# EAGLE design mainV1.0 (EAGLE 8.6.0)
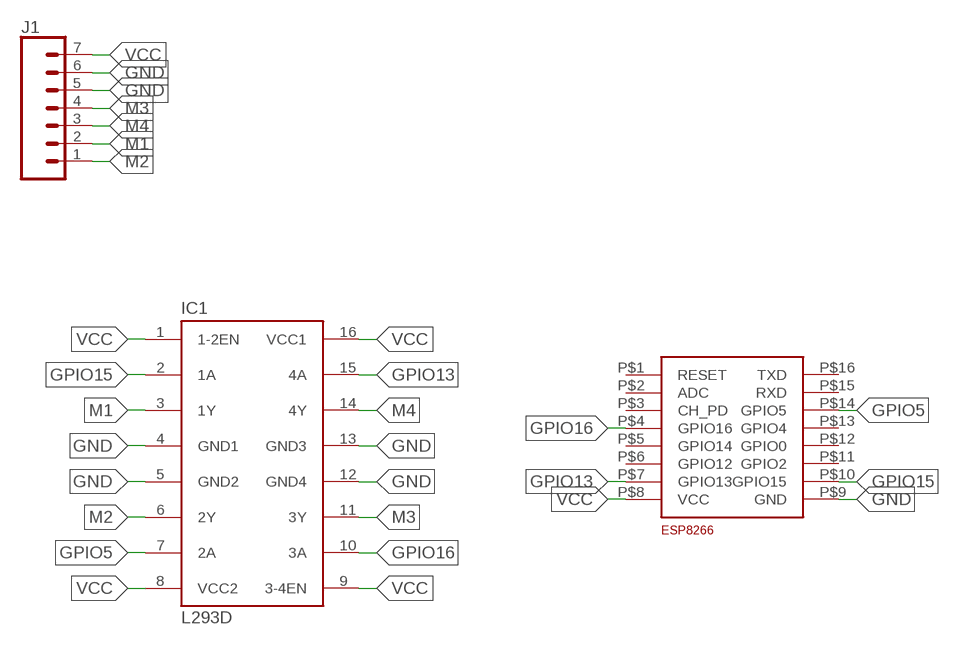
[diagram p0: schematic, sheet 1]

## Parts
IC1  L293D  [DIL16]
J1  CONN_07  [1X07]
U$1  ESP_THIAGO  [ESP_THIAGO]

## Nets
GND: IC1.4(GND1) IC1.5(GND2) IC1.12(GND4) IC1.13(GND3) J1.5 J1.6 U$1.P$9(GND)
GPIO5: IC1.7(2A) U$1.P$14(GPIO5)
GPIO13: IC1.15(4A) U$1.P$7(GPIO13)
GPIO15: IC1.2(1A) U$1.P$10(GPIO15)
GPIO16: IC1.10(3A) U$1.P$4(GPIO16)
M1: IC1.3(1Y) J1.2
M2: IC1.6(2Y) J1.1
M3: IC1.11(3Y) J1.4
M4: IC1.14(4Y) J1.3
N$1: IC1.8(VCC2)
VCC: IC1.1(1-2EN) IC1.9(3-4EN) IC1.16(VCC1) J1.7 U$1.P$8(VCC)
Unconnected: U$1.P$1(RESET) U$1.P$2(ADC) U$1.P$3(CH_PD) U$1.P$5(GPIO14) U$1.P$6(GPIO12) U$1.P$11(GPIO2) U$1.P$12(GPIO0) U$1.P$13(GPIO4) U$1.P$15(RXD) U$1.P$16(TXD)

## Library data of the parts
IC1 = st-microelectronics:L293D: PUSH-PULL 4 CHANNEL DRIVER; MPN: L293D; OC_FARNELL: 9589619; OC_NEWARK: 56P8249
J1 = SparkFun-Connectors:CONN_07: Multi connection point. Often used as Generic Header-pin footprint for 0.1 inch spaced/style header connections On any of the 0.1 inch spaced packages, you can populate with these: Break Away Headers - Straight <https://www.sparkfun.com/products/116> (PRT-00116) Break Away Male Headers - Right Angle <https://www.sparkfun.com/products/553> (PRT-00553) Female Headers <https://www.sparkfun.com/products/115> (PRT-00115) Break Away Headers - Machine Pin <https://www.sparkfun.com/products/117> (PRT-00117) Break Away Female Headers - Swiss Machine Pin <https://www.sparkfun.com/products/743> (PRT-00743) For SCREWTERMINALS and SPRING TERMINALS visit here: Screw Terimnals on SparkFun.com <https://www.sparkfun.com/search/results?term=Screw+Terminals> (5mm/3.5mm/2.54mm spacing) This device is also useful as a general connection point to wire up your design to another part of your project. Our various solder wires solder well into these plated through hole pads. Hook-Up Wire - Assortment (Stranded, 22 AWG) <https://www.sparkfun.com/products/11375> (PRT-11375) Hook-Up Wire - Assortment (Solid Core, 22 AWG) <https://www.sparkfun.com/products/11367> (PRT-11367) View the entire wire category on our website here <https://www.sparkfun.com/categories/141> Special notes: Molex polarized connector foot print use with SKU : PRT-08231 with associated crimp pins and housings. 1MM SMD Version SKU: PRT-10208 NOTES ON THE VARIANTS LOCK and LOCK_LONGPADS... This footprint was designed to help hold the alignment of a through-hole component (i.e. 6-pin header) while soldering it into place. You may notice that each hole has been shifted either up or down by 0.005 of an inch from it's more standard position (which is a perfectly straight line). This slight alteration caused the pins (the squares in the middle) to touch the edges of the holes. Because they are alternating, it causes a "brace" to hold the component in place. 0.005 has proven to be the perfect amount of "off-center" position when using our standard breakaway headers. Although looks a little odd when you look at the bare footprint, once you have a header in there, the alteration is very hard to notice. Also,if you push a header all the way into place, it is covered up entirely on the bottom side.
U$1 = esp8266:ESP_THIAGO

## Board
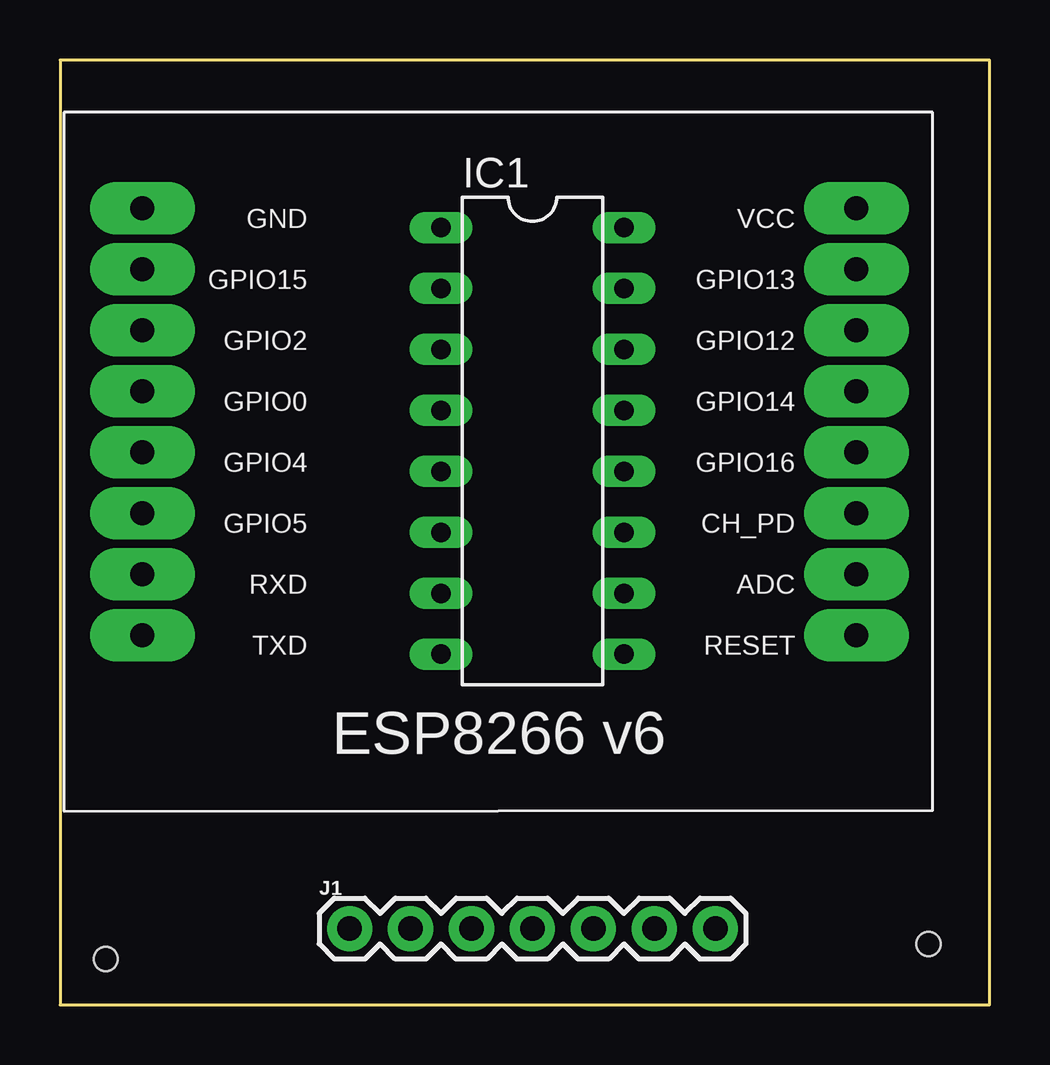
[diagram p1: board, top side]
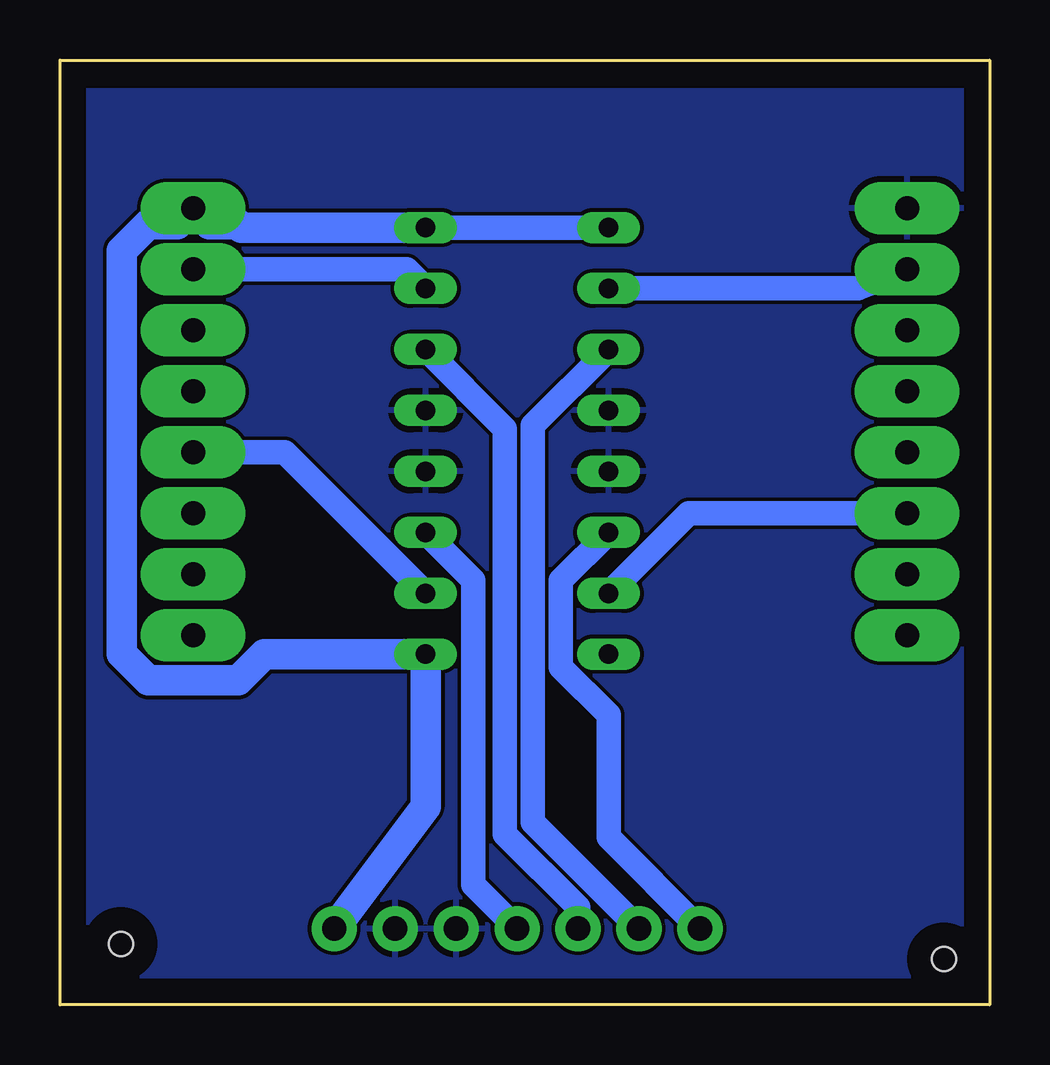
[diagram p2: board, bottom side, seen from below]

Size 38.73 x 39.36 mm. Coordinates in mm from the lower left corner, seen from the top.
Outline: 0,0 38.73,0 38.73,39.36 0,39.36 0,0
Copper layers (1*16): Top 0.035mm / dielectric 1.5mm / Bottom 0.035mm
Design rules "default": minimum track width 6mil, minimum drill 0.35mm, track to track 6mil, track to pad 6mil, pad to pad 6mil, via to via 6mil, smd to smd 6mil, copper to edge 40mil, drill to drill 6mil, minimum pad ring 10mil, minimum via ring 8mil, stop-mask expansion 4mil, vias tented up to drill 0mil, thermal gap 10mil
Holes 1 mm at 36.2,2.54 1.91,1.91

### Footprints (pad centres in the part's own frame; a part is rotated, then mirrored left to right if it is on the bottom)
DIL16 = drill 0.813 long: 1 -8.89,-3.81; 2 -6.35,-3.81; 3 -3.81,-3.81; 4 -1.27,-3.81; 5 1.27,-3.81; 6 3.81,-3.81; 7 6.35,-3.81; 8 8.89,-3.81; 9 8.89,3.81; 10 6.35,3.81; 11 3.81,3.81; 12 1.27,3.81; 13 -1.27,3.81; 14 -3.81,3.81; 15 -6.35,3.81; 16 -8.89,3.81
1X07 = drill 1.016 pad 1.88: 1 0,0; 2 2.54,0; 3 5.08,0; 4 7.62,0; 5 10.16,0; 6 12.7,0; 7 15.24,0
ESP_THIAGO = drill 1 pad 2.184 long: P$1 0,17.78; P$2 0,15.24; P$3 0,12.7; P$4 0,10.16; P$5 0,7.62; P$6 0,5.08; P$7 0,2.54; P$8 0,0; P$9 29.75,0; P$10 29.75,2.54; P$11 29.75,5.08; P$12 29.75,7.62; P$13 29.75,10.16; P$14 29.75,12.7; P$15 29.75,15.24; P$16 29.75,17.78

### Placement (x,y rotation side)
IC1  19.68,23.5 270 top
J1  12.06,3.17 0 top
U$1  33.18,33.18 180 top

### Tracks (layer width: path | path; a pad name or v marks a point on that pad's centre or on a via)
GND
  pour Bottom: 0.64,38.1 0.64,1.91 2.54,0.64 35.56,0.64 38.1,2.54 38.1,38.1
GPIO5
  Bottom 1.016: U$1.P$14 12.54,20.48 IC1.7
GPIO13
  Bottom 1.016: IC1.15 24.29,30.64 U$1.P$7
GPIO15
  Bottom 1.016: U$1.P$10 5.47,29.85 IC1.2
GPIO16
  Bottom 1.016: IC1.10 29.37,23.02 U$1.P$4
M1
  Bottom 1.016: IC1.3 15.88,27.29 19.02,24.14 19.02,7.59 J1.2
M2
  Bottom 1.016: J1.1 15.88,6.98 15.88,12.08 17.86,14.06 17.86,17.69 15.88,19.67 IC1.6
M3
  Bottom 1.016: IC1.11 23.5,19.67 21.51,17.69 21.51,5 J1.4
M4
  Bottom 1.016: IC1.14 20.19,24 20.19,7.11 17.14,4.06 J1.3
VCC
  Bottom 1.016: IC1.1 IC1.16
  Bottom 1.27: J1.7 23.5,8.26 IC1.9 30.22,14.61 31.31,13.52 35.05,13.52 36.15,14.62 36.15,31.42 35.05,32.52 33.84,32.52 U$1.P$8 32.52,32.52 31.31,32.52 31.18,32.38 IC1.16